# Altium schematic sheet ESP32.SchDoc
size A3
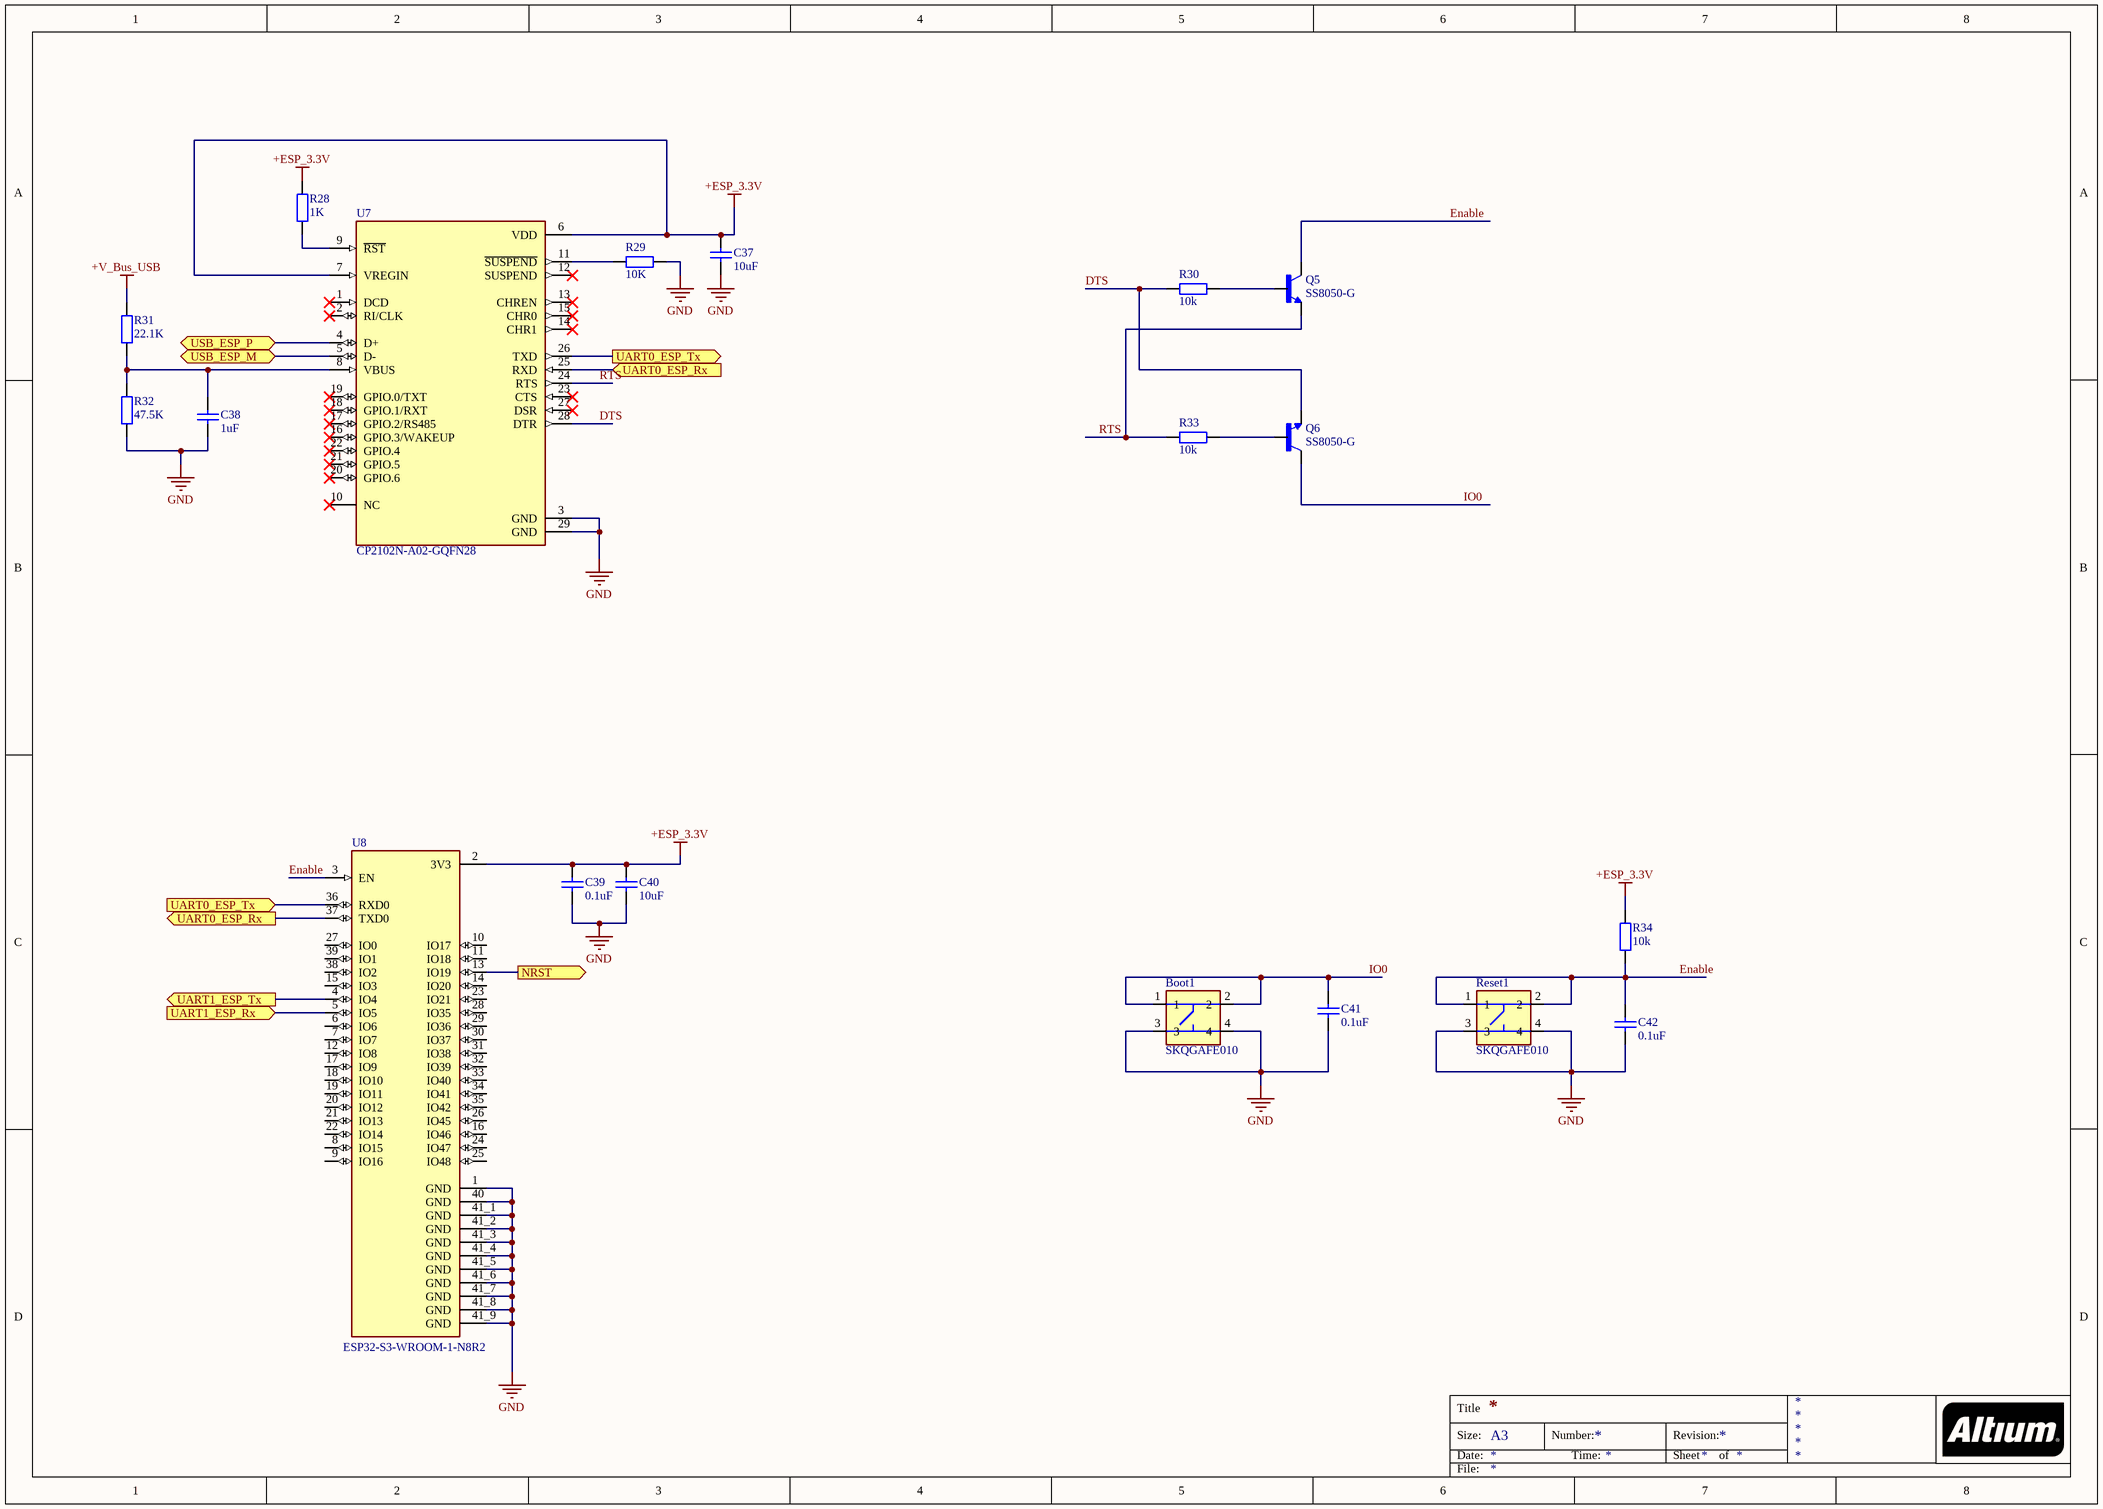
[diagram p0: ESP32.SchDoc]

## Parts
Boot1  SKQGAFE010  [SW_SKQGAFE010]
C37  10uF  [tu 0805]
C38  1uF  [tu 0805]
C39  0.1uF  [tu 0805]
C40  10uF  [tu 0805]
C41  0.1uF  [tu 0805]
C42  0.1uF  [tu 0805]
Q5  SS8050-G  [TRANS_SS8050-G]
Q6  SS8050-G  [TRANS_SS8050-G]
R28  1K  [tro smd 0805]
R29  10K  [tro smd 0805]
R30  10k  [tro smd 0805]
R31  22.1K  [tro smd 0805]
R32  47.5K  [tro smd 0805]
R33  10k  [tro smd 0805]
R34  10k  [tro smd 0805]
Reset1  SKQGAFE010  [SW_SKQGAFE010]
U7  CP2102N-A02-GQFN28  [QFN50P500X500X80-29N]
U8  ESP32-S3-WROOM-1-N8R2  [XCVR_ESP32-S3-WROOM-1-N8R2]

## Ports
NRST (out), UART0_ESP_Rx (in), UART0_ESP_Rx (out), UART0_ESP_Tx (in), UART0_ESP_Tx (out), UART1_ESP_Rx (in), UART1_ESP_Tx (out), USB_ESP_M (bidir), USB_ESP_P (bidir)

## Nets
+ESP_3.3V: C37.1 C39.2 C40.1 R28.2 R34.2 U7.6(VDD) U7.7(VREGIN) U8.2(3V3)
+V_Bus_USB: R31.1
GND: Boot1.3 Boot1.4 C37.2 C38.2 C39.1 C40.2 C41.1 C42.1 R29.1 R32.1 Reset1.3 Reset1.4 U7.3(GND) U7.29(GND) U8.1(GND) U8.40(GND) U8.41_1(GND) U8.41_2(GND) U8.41_3(GND) U8.41_4(GND) U8.41_5(GND) U8.41_6(GND) U8.41_7(GND) U8.41_8(GND) U8.41_9(GND)
DTS: Q6.2(E) R30.1 U7.28(DTR)
Enable: C42.2 Q5.3(C) R34.1 Reset1.1 Reset1.2 U8.3(EN)
IO0: Boot1.1 Boot1.2 C41.2 Q6.3(C)
NRST: U8.13(IO19) ; port NRST
RTS: Q5.2(E) R33.1 U7.24(RTS)
UART0_ESP_Rx: U7.25(RXD) U8.37(TXD0) ; port UART0_ESP_Rx
UART0_ESP_Tx: U7.26(TXD) U8.36(RXD0) ; port UART0_ESP_Tx
UART1_ESP_Rx: U8.5(IO5) ; port UART1_ESP_Rx
UART1_ESP_Tx: U8.4(IO4) ; port UART1_ESP_Tx
USB_ESP_M: U7.5(D-) ; port USB_ESP_M
USB_ESP_P: U7.4(D+) ; port USB_ESP_P
NetC38_1: C38.1 R31.2 R32.2 U7.8(VBUS)
NetQ5_1: Q5.1(B) R30.2
NetQ6_1: Q6.1(B) R33.2
NetR28_1: R28.1 U7.9(~{RST})
NetR29_2: R29.2 U7.11(~{SUSPEND})

Not connected (* = marked no-connect by the designer): U7 1(DCD)* 2(RI/CLK)* 10(NC)* 12(SUSPEND)* 13(CHREN)* 14(CHR1)* 15(CHR0)* 16(GPIO.3/WAKEUP)* 17(GPIO.2/RS485)* 18(GPIO.1/RXT)* 19(GPIO.0/TXT)* 20(GPIO.6)* 21(GPIO.5)* 22(GPIO.4)* 23(CTS)* 27(DSR)*; U8 6(IO6) 7(IO7) 8(IO15) 9(IO16) 10(IO17) 11(IO18) 12(IO8) 14(IO20) 15(IO3) 16(IO46) 17(IO9) 18(IO10) 19(IO11) 20(IO12) 21(IO13) 22(IO14) 23(IO21) 24(IO47) 25(IO48) 26(IO45) 27(IO0) 28(IO35) 29(IO36) 30(IO37) 31(IO38) 32(IO39) 33(IO40) 34(IO41) 35(IO42) 38(IO2) 39(IO1)

## Notes on the sheet
- Title
- Size:
- Date:
- A3
- Number:
- Time:
- Revision:
- Sheet
- of
- File:

## Library data of the parts
Boot1 Reset1 = SKQGAFE010: Switch Tactile N.O. SPST Button Gull Wing 0.05A 12VDC 0.98N SMD T/R; MF: {'manufacturer': u'ALPS'}; Package: None; Price: None; Value: *; MP: SKQGAFE010; Availability: Unavailable
C37-C42 = Tu 0805 10pF 50V 10%: Dán; Don_Vi: Con; So_Chan: 2; Ten_Linh_Kien: Tụ 0805 10P 10% 50V; Ma_Hang: MH004554; Chung_Loai: Dán; Kieu_Chan: *
Q5 Q6 = SS8050-G: Bipolar (BJT) Transistor NPN 25 V 1.5 A 100MHz 300 mW Surface Mount SOT-23-3; MF: {'manufacturer': u'Comchip Technology'}; Package: None; Price: None; Value: *; MP: SS8050-G; Availability: Unavailable
R28-R34 = Tro 0805 1% 1k: Dán; Don_Vi: Con; So_Chan: 2; Ten_Linh_Kien: Trở 0805 1% 1k; Ma_Hang: MH005468; Chung_Loai: Dán; Kieu_Chan: *
U7 = CP2102N-A02-GQFN28: MF: {'manufacturer': u'Silicon Labs'}; Package: None; Price: None; Value: *; MP: CP2102N-A02-GQFN28; Availability: Unavailable
U8 = ESP32-S3-WROOM-1-N8R2: MF: {'manufacturer': u'Espressif Systems'}; Package: None; Price: None; Value: *; MP: ESP32-S3-WROOM-1-N8R2; Availability: Unavailable